# EAGLE design mml_matrix (EAGLE 9.7.0)
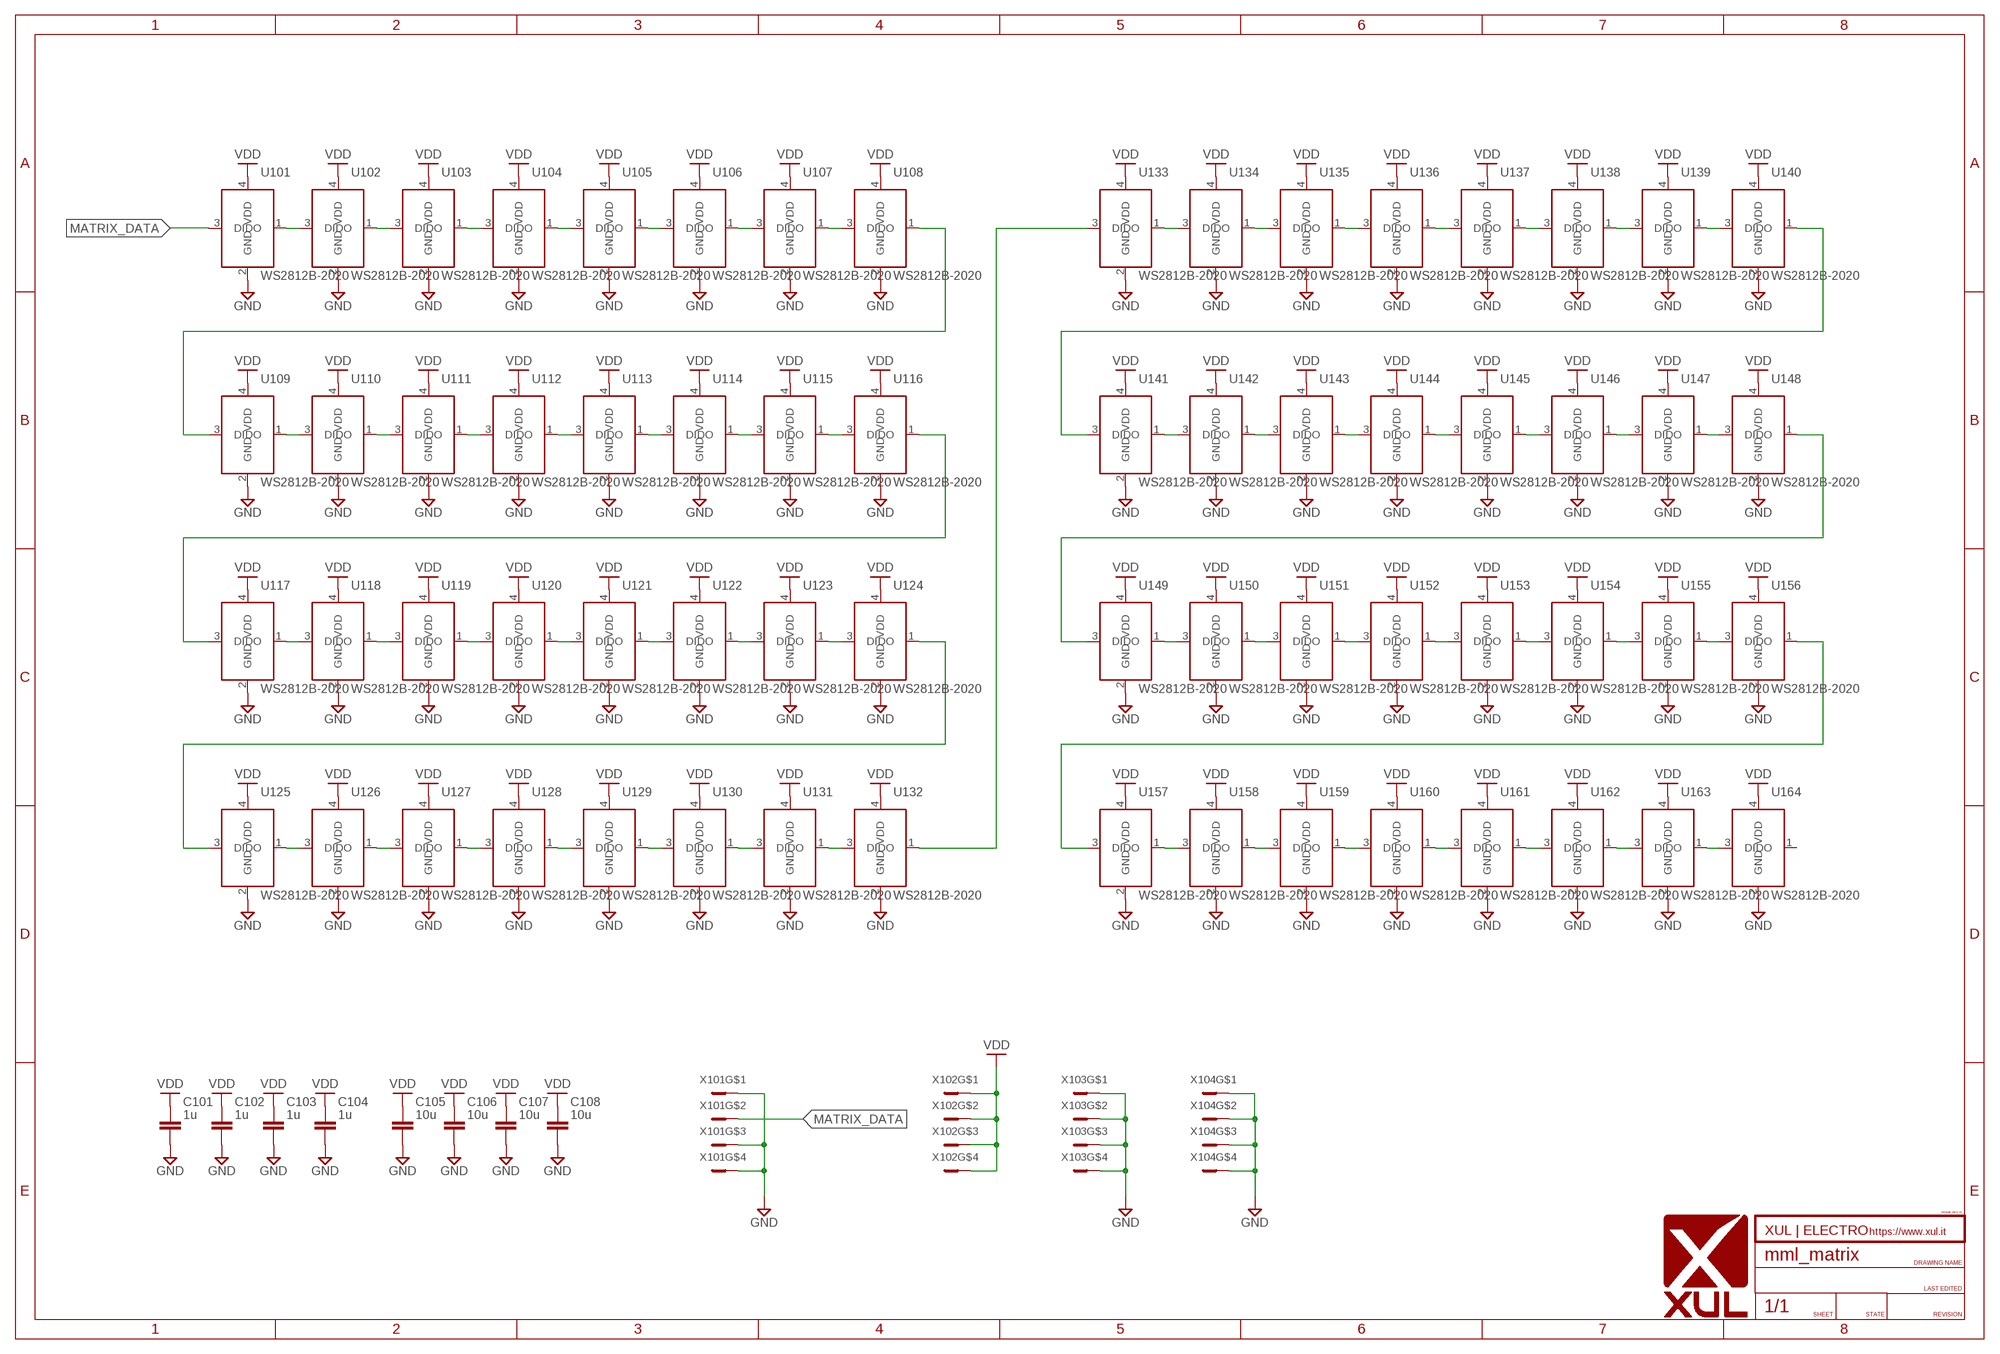
[diagram p0: schematic, sheet 1]

## Parts
C101  1u  C_CHIP-0603(1608-METRIC)  [CAPC1608X85]
C102  1u  C_CHIP-0603(1608-METRIC)  [CAPC1608X85]
C103  1u  C_CHIP-0603(1608-METRIC)  [CAPC1608X85]
C104  1u  C_CHIP-0603(1608-METRIC)  [CAPC1608X85]
C105  10u  C_CHIP-0805(2012-METRIC)  [CAPC2012X110]
C106  10u  C_CHIP-0805(2012-METRIC)  [CAPC2012X110]
C107  10u  C_CHIP-0805(2012-METRIC)  [CAPC2012X110]
C108  10u  C_CHIP-0805(2012-METRIC)  [CAPC2012X110]
U101  WS2812B-2020  [RESCAV100P200X220X28-4L]
U102  WS2812B-2020  [RESCAV100P200X220X28-4L]
U103  WS2812B-2020  [RESCAV100P200X220X28-4L]
U104  WS2812B-2020  [RESCAV100P200X220X28-4L]
U105  WS2812B-2020  [RESCAV100P200X220X28-4L]
U106  WS2812B-2020  [RESCAV100P200X220X28-4L]
U107  WS2812B-2020  [RESCAV100P200X220X28-4L]
U108  WS2812B-2020  [RESCAV100P200X220X28-4L]
U109  WS2812B-2020  [RESCAV100P200X220X28-4L]
U110  WS2812B-2020  [RESCAV100P200X220X28-4L]
U111  WS2812B-2020  [RESCAV100P200X220X28-4L]
U112  WS2812B-2020  [RESCAV100P200X220X28-4L]
U113  WS2812B-2020  [RESCAV100P200X220X28-4L]
U114  WS2812B-2020  [RESCAV100P200X220X28-4L]
U115  WS2812B-2020  [RESCAV100P200X220X28-4L]
U116  WS2812B-2020  [RESCAV100P200X220X28-4L]
U117  WS2812B-2020  [RESCAV100P200X220X28-4L]
U118  WS2812B-2020  [RESCAV100P200X220X28-4L]
U119  WS2812B-2020  [RESCAV100P200X220X28-4L]
U120  WS2812B-2020  [RESCAV100P200X220X28-4L]
U121  WS2812B-2020  [RESCAV100P200X220X28-4L]
U122  WS2812B-2020  [RESCAV100P200X220X28-4L]
U123  WS2812B-2020  [RESCAV100P200X220X28-4L]
U124  WS2812B-2020  [RESCAV100P200X220X28-4L]
U125  WS2812B-2020  [RESCAV100P200X220X28-4L]
U126  WS2812B-2020  [RESCAV100P200X220X28-4L]
U127  WS2812B-2020  [RESCAV100P200X220X28-4L]
U128  WS2812B-2020  [RESCAV100P200X220X28-4L]
U129  WS2812B-2020  [RESCAV100P200X220X28-4L]
U130  WS2812B-2020  [RESCAV100P200X220X28-4L]
U131  WS2812B-2020  [RESCAV100P200X220X28-4L]
U132  WS2812B-2020  [RESCAV100P200X220X28-4L]
U133  WS2812B-2020  [RESCAV100P200X220X28-4L]
U134  WS2812B-2020  [RESCAV100P200X220X28-4L]
U135  WS2812B-2020  [RESCAV100P200X220X28-4L]
U136  WS2812B-2020  [RESCAV100P200X220X28-4L]
U137  WS2812B-2020  [RESCAV100P200X220X28-4L]
U138  WS2812B-2020  [RESCAV100P200X220X28-4L]
U139  WS2812B-2020  [RESCAV100P200X220X28-4L]
U140  WS2812B-2020  [RESCAV100P200X220X28-4L]
U141  WS2812B-2020  [RESCAV100P200X220X28-4L]
U142  WS2812B-2020  [RESCAV100P200X220X28-4L]
U143  WS2812B-2020  [RESCAV100P200X220X28-4L]
U144  WS2812B-2020  [RESCAV100P200X220X28-4L]
U145  WS2812B-2020  [RESCAV100P200X220X28-4L]
U146  WS2812B-2020  [RESCAV100P200X220X28-4L]
U147  WS2812B-2020  [RESCAV100P200X220X28-4L]
U148  WS2812B-2020  [RESCAV100P200X220X28-4L]
U149  WS2812B-2020  [RESCAV100P200X220X28-4L]
U150  WS2812B-2020  [RESCAV100P200X220X28-4L]
U151  WS2812B-2020  [RESCAV100P200X220X28-4L]
U152  WS2812B-2020  [RESCAV100P200X220X28-4L]
U153  WS2812B-2020  [RESCAV100P200X220X28-4L]
U154  WS2812B-2020  [RESCAV100P200X220X28-4L]
U155  WS2812B-2020  [RESCAV100P200X220X28-4L]
U156  WS2812B-2020  [RESCAV100P200X220X28-4L]
U157  WS2812B-2020  [RESCAV100P200X220X28-4L]
U158  WS2812B-2020  [RESCAV100P200X220X28-4L]
U159  WS2812B-2020  [RESCAV100P200X220X28-4L]
U160  WS2812B-2020  [RESCAV100P200X220X28-4L]
U161  WS2812B-2020  [RESCAV100P200X220X28-4L]
U162  WS2812B-2020  [RESCAV100P200X220X28-4L]
U163  WS2812B-2020  [RESCAV100P200X220X28-4L]
U164  WS2812B-2020  [RESCAV100P200X220X28-4L]
X101  HW-02-10-T-D-500-SM  [HW-02-10-T-D-500-SM]
X102  HW-02-10-T-D-500-SM  [HW-02-10-T-D-500-SM]
X103  HW-02-10-T-D-500-SM  [HW-02-10-T-D-500-SM]
X104  HW-02-10-T-D-500-SM  [HW-02-10-T-D-500-SM]

## Nets
GND: C101.2 C102.2 C103.2 C104.2 C105.2 C106.2 C107.2 C108.2 U101.2(GND) U102.2(GND) U103.2(GND) U104.2(GND) U105.2(GND) U106.2(GND) U107.2(GND) U108.2(GND) U109.2(GND) U110.2(GND) U111.2(GND) U112.2(GND) U113.2(GND) U114.2(GND) U115.2(GND) U116.2(GND) U117.2(GND) U118.2(GND) U119.2(GND) U120.2(GND) U121.2(GND) U122.2(GND) U123.2(GND) U124.2(GND) U125.2(GND) U126.2(GND) U127.2(GND) U128.2(GND) U129.2(GND) U130.2(GND) U131.2(GND) U132.2(GND) U133.2(GND) U134.2(GND) U135.2(GND) U136.2(GND) U137.2(GND) U138.2(GND) U139.2(GND) U140.2(GND) U141.2(GND) U142.2(GND) U143.2(GND) U144.2(GND) U145.2(GND) U146.2(GND) U147.2(GND) U148.2(GND) U149.2(GND) U150.2(GND) U151.2(GND) U152.2(GND) U153.2(GND) U154.2(GND) U155.2(GND) U156.2(GND) U157.2(GND) U158.2(GND) U159.2(GND) U160.2(GND) U161.2(GND) U162.2(GND) U163.2(GND) U164.2(GND) X101.P$1 X101.P$3 X101.P$4 X103.P$1 X103.P$2 X103.P$3 X103.P$4 X104.P$1 X104.P$2 X104.P$3 X104.P$4
MATRIX_DATA: U101.3(DI) X101.P$2
N$1: U101.1(DO) U102.3(DI)
N$2: U102.1(DO) U103.3(DI)
N$3: U103.1(DO) U104.3(DI)
N$4: U104.1(DO) U105.3(DI)
N$5: U105.1(DO) U106.3(DI)
N$6: U106.1(DO) U107.3(DI)
N$7: U107.1(DO) U108.3(DI)
N$8: U117.1(DO) U118.3(DI)
N$9: U118.1(DO) U119.3(DI)
N$10: U119.1(DO) U120.3(DI)
N$11: U120.1(DO) U121.3(DI)
N$12: U121.1(DO) U122.3(DI)
N$13: U122.1(DO) U123.3(DI)
N$14: U123.1(DO) U124.3(DI)
N$15: U133.1(DO) U134.3(DI)
N$16: U134.1(DO) U135.3(DI)
N$17: U135.1(DO) U136.3(DI)
N$18: U136.1(DO) U137.3(DI)
N$19: U137.1(DO) U138.3(DI)
N$20: U138.1(DO) U139.3(DI)
N$21: U139.1(DO) U140.3(DI)
N$22: U149.1(DO) U150.3(DI)
N$23: U150.1(DO) U151.3(DI)
N$24: U151.1(DO) U152.3(DI)
N$25: U152.1(DO) U153.3(DI)
N$26: U153.1(DO) U154.3(DI)
N$27: U154.1(DO) U155.3(DI)
N$28: U155.1(DO) U156.3(DI)
N$29: U109.1(DO) U110.3(DI)
N$30: U110.1(DO) U111.3(DI)
N$31: U111.1(DO) U112.3(DI)
N$32: U112.1(DO) U113.3(DI)
N$33: U113.1(DO) U114.3(DI)
N$34: U114.1(DO) U115.3(DI)
N$35: U115.1(DO) U116.3(DI)
N$36: U125.1(DO) U126.3(DI)
N$37: U126.1(DO) U127.3(DI)
N$38: U127.1(DO) U128.3(DI)
N$39: U128.1(DO) U129.3(DI)
N$40: U129.1(DO) U130.3(DI)
N$41: U130.1(DO) U131.3(DI)
N$42: U131.1(DO) U132.3(DI)
N$43: U141.1(DO) U142.3(DI)
N$44: U142.1(DO) U143.3(DI)
N$45: U143.1(DO) U144.3(DI)
N$46: U144.1(DO) U145.3(DI)
N$47: U145.1(DO) U146.3(DI)
N$48: U146.1(DO) U147.3(DI)
N$49: U147.1(DO) U148.3(DI)
N$50: U157.1(DO) U158.3(DI)
N$51: U158.1(DO) U159.3(DI)
N$52: U159.1(DO) U160.3(DI)
N$53: U160.1(DO) U161.3(DI)
N$54: U161.1(DO) U162.3(DI)
N$55: U162.1(DO) U163.3(DI)
N$56: U163.1(DO) U164.3(DI)
N$57: U108.1(DO) U109.3(DI)
N$58: U116.1(DO) U117.3(DI)
N$59: U124.1(DO) U125.3(DI)
N$60: U132.1(DO) U133.3(DI)
N$61: U140.1(DO) U141.3(DI)
N$62: U148.1(DO) U149.3(DI)
N$63: U156.1(DO) U157.3(DI)
VDD: C101.1 C102.1 C103.1 C104.1 C105.1 C106.1 C107.1 C108.1 U101.4(VDD) U102.4(VDD) U103.4(VDD) U104.4(VDD) U105.4(VDD) U106.4(VDD) U107.4(VDD) U108.4(VDD) U109.4(VDD) U110.4(VDD) U111.4(VDD) U112.4(VDD) U113.4(VDD) U114.4(VDD) U115.4(VDD) U116.4(VDD) U117.4(VDD) U118.4(VDD) U119.4(VDD) U120.4(VDD) U121.4(VDD) U122.4(VDD) U123.4(VDD) U124.4(VDD) U125.4(VDD) U126.4(VDD) U127.4(VDD) U128.4(VDD) U129.4(VDD) U130.4(VDD) U131.4(VDD) U132.4(VDD) U133.4(VDD) U134.4(VDD) U135.4(VDD) U136.4(VDD) U137.4(VDD) U138.4(VDD) U139.4(VDD) U140.4(VDD) U141.4(VDD) U142.4(VDD) U143.4(VDD) U144.4(VDD) U145.4(VDD) U146.4(VDD) U147.4(VDD) U148.4(VDD) U149.4(VDD) U150.4(VDD) U151.4(VDD) U152.4(VDD) U153.4(VDD) U154.4(VDD) U155.4(VDD) U156.4(VDD) U157.4(VDD) U158.4(VDD) U159.4(VDD) U160.4(VDD) U161.4(VDD) U162.4(VDD) U163.4(VDD) U164.4(VDD) X102.P$1 X102.P$2 X102.P$3 X102.P$4
Unconnected: U164.1(DO)

## Library data of the parts
C101-C108 = Capacitor:C: Capacitor - Generic; CATEGORY: Capacitor
U101-U164 = xul:WS2812B
X101-X104 = xul:HW-02-10-T-D-500-SM: HW-02-10-T-D-500-SM 2x2 SMD High Temperature Flexible Board Stacking Header, 0.100" Pitch

## Board
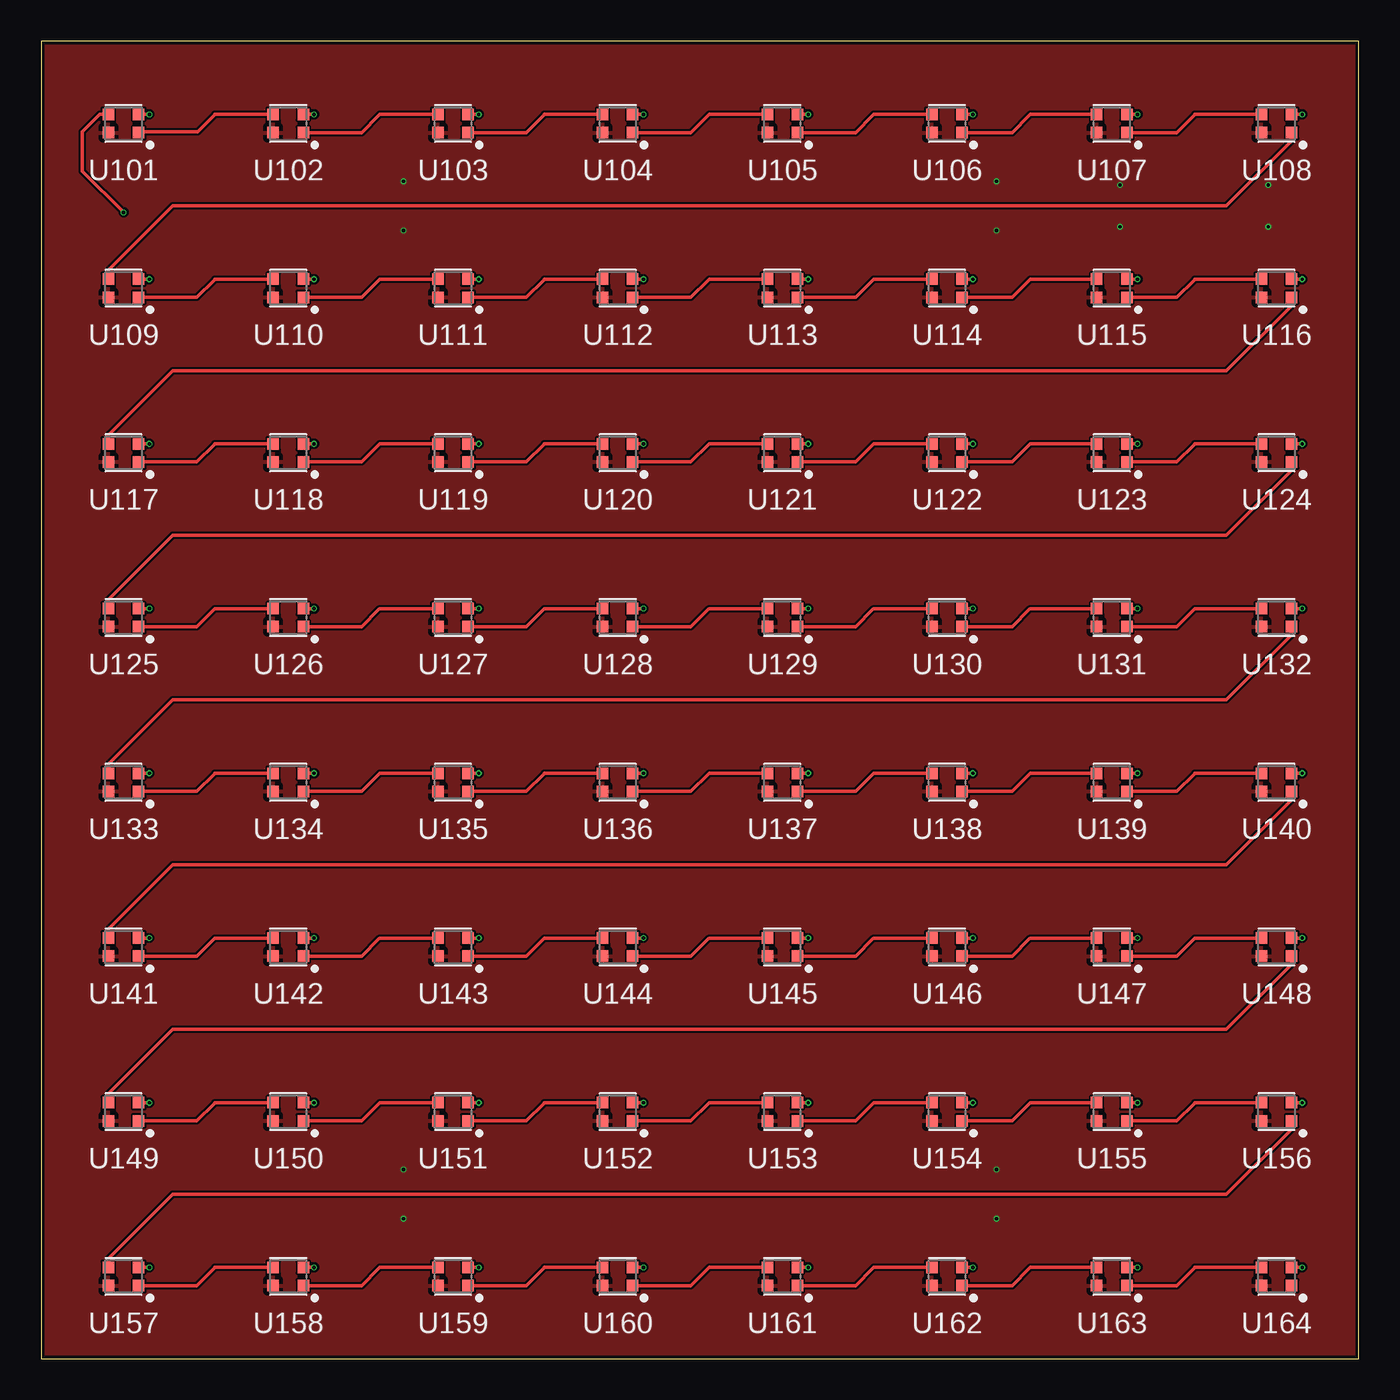
[diagram p1: board, top side]
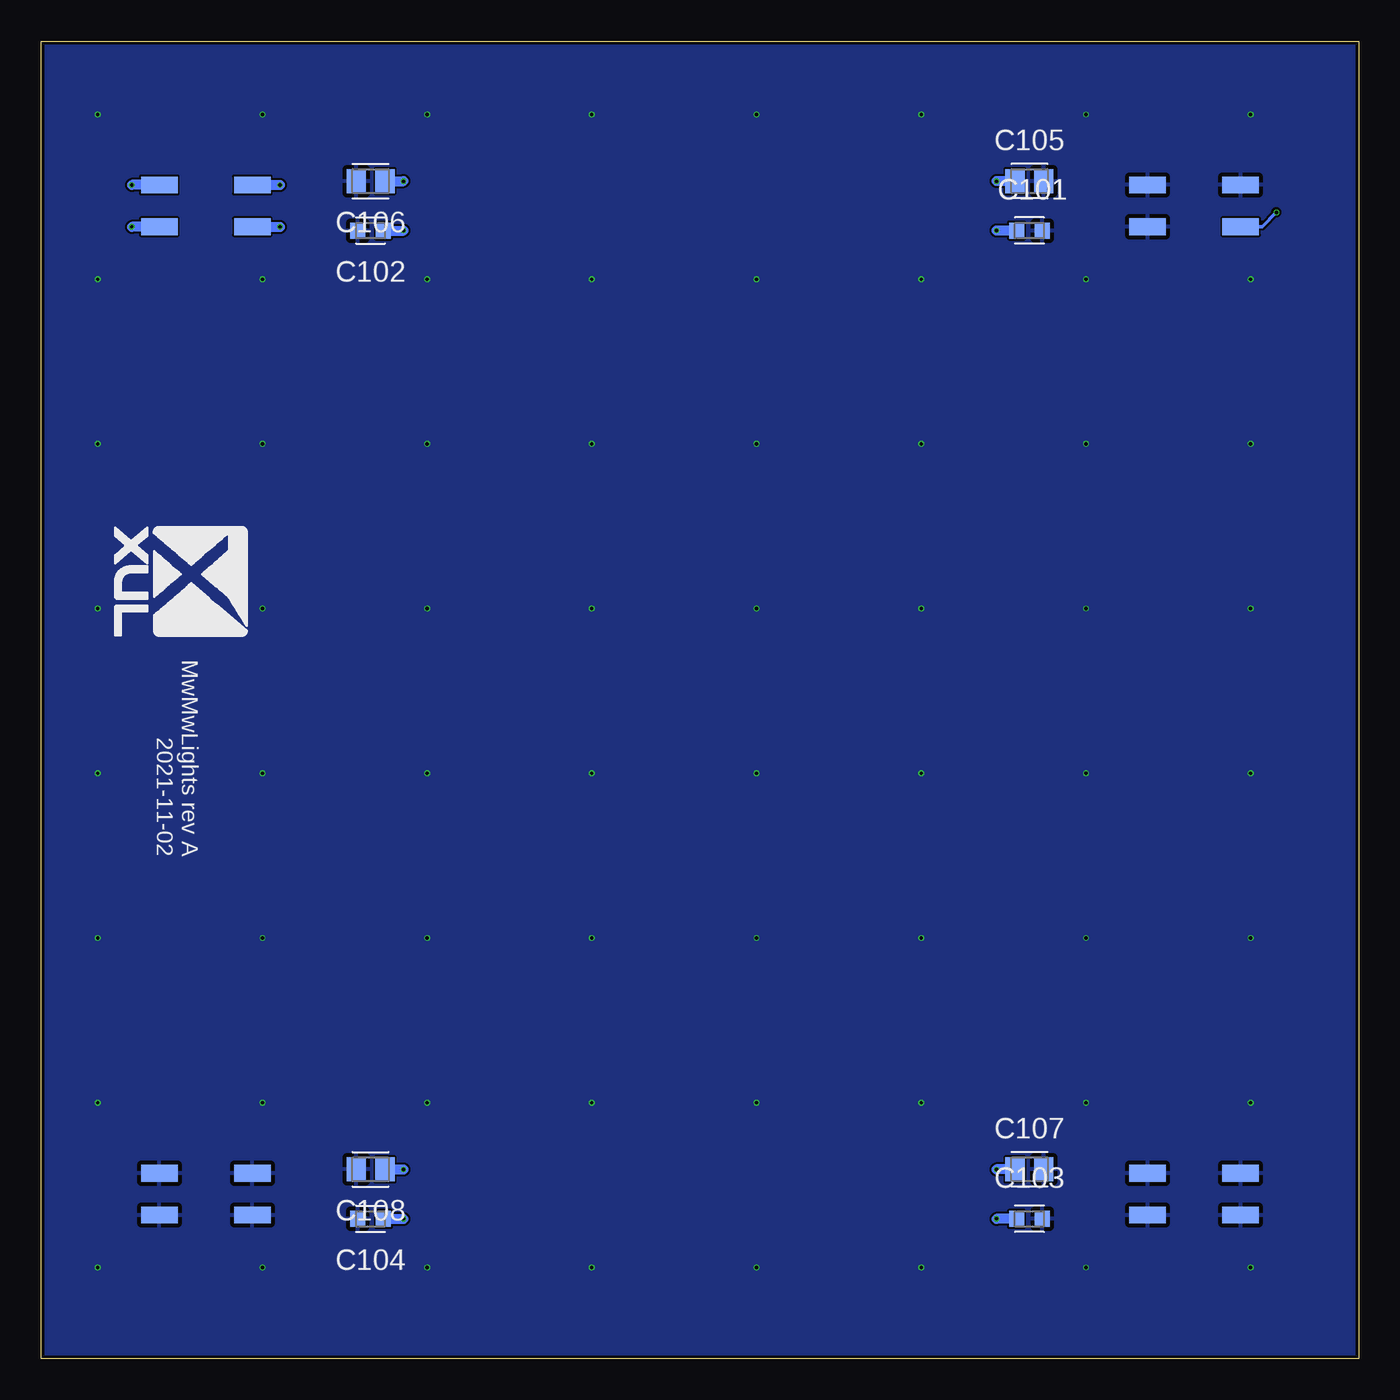
[diagram p2: board, bottom side, seen from below]

Size 80 x 80 mm. Coordinates in mm from the lower left corner, seen from the top.
Outline: 0,0 80,0 80,80 0,80 0,0
Copper layers (1*16): Top 0.035mm / dielectric 1.6mm / Bottom 0.035mm
Design rules "jlcpcb-2layers *": minimum track width 5mil, minimum drill 0.2mm, track to track 5mil, track to pad 5mil, pad to pad 5mil, via to via 5mil, smd to smd 5mil, copper to edge 0.2mm, drill to drill 6mil, minimum pad ring 10mil, minimum via ring 3mil, stop-mask expansion 4mil, vias tented up to drill 0mil, thermal gap 10mil

### Footprints (pad centres in the part's own frame; a part is rotated, then mirrored left to right if it is on the bottom)
CAPC1608X85 = smd 0.921 x 0.97: 1 -0.775,0; 2 0.775,0
CAPC2012X110 = smd 1.165 x 1.465: 1 -0.875,0; 2 0.875,0
RESCAV100P200X220X28-4L = smd 0.7 x 0.7: 1 -0.915,0.55; 2 -0.915,-0.55; 3 0.915,-0.55; 4 0.915,0.55
HW-02-10-T-D-500-SM = smd 1.016 x 2.223: P$1 -1.27,2.826; P$2 1.27,2.826; P$3 -1.27,-2.826; P$4 1.27,-2.826

### Placement (x,y rotation side)
C101  20,68.5 0 bottom
C102  60,68.5 180 bottom
C103  20,8.5 0 bottom
C104  60,8.5 180 bottom
C105  20,71.5 0 bottom
C106  60,71.5 180 bottom
C107  20,11.5 0 bottom
C108  60,11.5 180 bottom
U101  5,75 180 top
U102  15,75 180 top
U103  25,75 180 top
U104  35,75 180 top
U105  45,75 180 top
U106  55,75 180 top
U107  65,75 180 top
U108  75,75 180 top
U109  5,65 180 top
U110  15,65 180 top
U111  25,65 180 top
U112  35,65 180 top
U113  45,65 180 top
U114  55,65 180 top
U115  65,65 180 top
U116  75,65 180 top
U117  5,55 180 top
U118  15,55 180 top
U119  25,55 180 top
U120  35,55 180 top
U121  45,55 180 top
U122  55,55 180 top
U123  65,55 180 top
U124  75,55 180 top
U125  5,45 180 top
U126  15,45 180 top
U127  25,45 180 top
U128  35,45 180 top
U129  45,45 180 top
U130  55,45 180 top
U131  65,45 180 top
U132  75,45 180 top
U133  5,35 180 top
U134  15,35 180 top
U135  25,35 180 top
U136  35,35 180 top
U137  45,35 180 top
U138  55,35 180 top
U139  65,35 180 top
U140  75,35 180 top
U141  5,25 180 top
U142  15,25 180 top
U143  25,25 180 top
U144  35,25 180 top
U145  45,25 180 top
U146  55,25 180 top
U147  65,25 180 top
U148  75,25 180 top
U149  5,15 180 top
U150  15,15 180 top
U151  25,15 180 top
U152  35,15 180 top
U153  45,15 180 top
U154  55,15 180 top
U155  65,15 180 top
U156  75,15 180 top
U157  5,5 180 top
U158  15,5 180 top
U159  25,5 180 top
U160  35,5 180 top
U161  45,5 180 top
U162  55,5 180 top
U163  65,5 180 top
U164  75,5 180 top
U$1  [XUL-LOGO-8MMH]  67.5,50.5 270 bottom
X101  10,70 270 bottom
X102  70,70 90 bottom
X103  10,10 270 bottom
X104  70,10 90 bottom

### Tracks (layer width: path | path; a pad name or v marks a point on that pad's centre or on a via)
GND  (via drill 0.2)
  Top 0.2: U142.2 v16.57,25.55 | U121.2 v46.57,55.55 | U143.2 v26.57,25.55 | U125.2 v6.57,45.55 | U146.2 v56.57,25.55 | U130.2 v56.57,45.55 | U104.2 v36.57,75.55 | U106.2 v56.57,75.55 | U101.2 v6.57,75.55 | U159.2 v26.57,5.55 | U112.2 v36.57,65.55 | U156.2 v76.57,15.55 | U160.2 v36.57,5.55 | U154.2 v56.57,15.55 | U110.2 v16.57,65.55 | U116.2 v76.57,65.55 | U109.2 v6.57,65.55 | U118.2 v16.57,55.55 | U145.2 v46.57,25.55 | U150.2 v16.57,15.55 | U102.2 v16.57,75.55 | U135.2 v26.57,35.55 | U119.2 v26.57,55.55 | U103.2 v26.57,75.55 | U107.2 v66.57,75.55 | U157.2 v6.57,5.55 | U136.2 v36.57,35.55 | U105.2 v46.57,75.55 | U139.2 v66.57,35.55 | U126.2 v16.57,45.55 | U113.2 v46.57,65.55 | U117.2 v6.57,55.55 | U141.2 v6.57,25.55 | U114.2 v56.57,65.55 | U134.2 v16.57,35.55 | U163.2 v66.57,5.55 | U108.2 v76.57,75.55 | U162.2 v56.57,5.55 | U111.2 v26.57,65.55 | U127.2 v26.57,45.55 | U120.2 v36.57,55.55 | U144.2 v36.57,25.55 | U122.2 v56.57,55.55 | U123.2 v66.57,55.55 | U128.2 v36.57,45.55 | U124.2 v76.57,55.55 | U133.2 v6.57,35.55 | U137.2 v46.57,35.55 | U140.2 v76.57,35.55 | U155.2 v66.57,15.55 | U158.2 v16.57,5.55 | U138.2 v56.57,35.55 | U149.2 v6.57,15.55 | U153.2 v46.57,15.55 | U151.2 v26.57,15.55 | U152.2 v36.57,15.55 | U148.2 v76.57,25.55 | U115.2 v66.57,65.55 | U164.2 v76.57,5.55 | U129.2 v46.57,45.55 | U131.2 v66.57,45.55 | U147.2 v66.57,25.55 | U132.2 v76.57,45.55 | U161.2 v46.57,5.55
  pour Bottom: 0.08,0.08 79.92,0.08 79.92,79.92 0.08,79.92
MATRIX_DATA  (via drill 0.2)
  Top 0.2: v5,69.6 2.5,72.1 2.5,74.5 3.55,75.55 U101.3
  Bottom 0.2: X101.P$2 5.87,68.73 v5,69.6
N$1
  Top 0.2: U101.1 5.96,74.5 9.5,74.5 10.5,75.5 10.55,75.55 U102.3
N$2
  Top 0.2: U102.1 19.45,74.45 20.5,75.5 20.55,75.55 U103.3
N$3
  Top 0.2: U103.1 29.45,74.45 30.5,75.5 30.55,75.55 U104.3
N$4
  Top 0.2: U104.1 39.45,74.45 40.5,75.5 40.55,75.55 U105.3
N$5
  Top 0.2: U105.1 49.45,74.45 50.5,75.5 50.55,75.55 U106.3
N$6
  Top 0.2: U106.1 58.95,74.45 60,75.5 60.05,75.55 U107.3
N$7
  Top 0.2: U107.1 68.95,74.45 70,75.5 70.05,75.55 U108.3
N$8
  Top 0.2: U117.1 9.45,54.45 10.5,55.5 10.55,55.55 U118.3
N$9
  Top 0.2: U118.1 19.45,54.45 20.5,55.5 20.55,55.55 U119.3
N$10
  Top 0.2: U119.1 29.45,54.45 30.5,55.5 30.55,55.55 U120.3
N$11
  Top 0.2: U120.1 39.45,54.45 40.5,55.5 40.55,55.55 U121.3
N$12
  Top 0.2: U121.1 49.45,54.45 50.5,55.5 50.55,55.55 U122.3
N$13
  Top 0.2: U122.1 58.95,54.45 60,55.5 60.05,55.55 U123.3
N$14
  Top 0.2: U123.1 68.95,54.45 70,55.5 70.05,55.55 U124.3
N$15
  Top 0.2: U133.1 9.45,34.45 10.5,35.5 10.55,35.55 U134.3
N$16
  Top 0.2: U134.1 19.45,34.45 20.5,35.5 20.55,35.55 U135.3
N$17
  Top 0.2: U135.1 29.45,34.45 30.5,35.5 30.55,35.55 U136.3
N$18
  Top 0.2: U136.1 39.45,34.45 40.5,35.5 40.55,35.55 U137.3
N$19
  Top 0.2: U137.1 49.45,34.45 50.5,35.5 50.55,35.55 U138.3
N$20
  Top 0.2: U138.1 58.95,34.45 60,35.5 60.05,35.55 U139.3
N$21
  Top 0.2: U139.1 68.95,34.45 70,35.5 70.05,35.55 U140.3
N$22
  Top 0.2: U149.1 9.45,14.45 10.5,15.5 10.55,15.55 U150.3
N$23
  Top 0.2: U150.1 19.45,14.45 20.5,15.5 20.55,15.55 U151.3
N$24
  Top 0.2: U151.1 29.45,14.45 30.5,15.5 30.55,15.55 U152.3
N$25
  Top 0.2: U152.1 39.45,14.45 40.5,15.5 40.55,15.55 U153.3
N$26
  Top 0.2: U153.1 49.45,14.45 50.5,15.5 50.55,15.55 U154.3
N$27
  Top 0.2: U154.1 58.95,14.45 60,15.5 60.05,15.55 U155.3
N$28
  Top 0.2: U155.1 68.95,14.45 70,15.5 70.05,15.55 U156.3
N$29
  Top 0.2: U109.1 9.45,64.45 10.5,65.5 10.55,65.55 U110.3
N$30
  Top 0.2: U110.1 19.45,64.45 20.5,65.5 20.55,65.55 U111.3
N$31
  Top 0.2: U111.1 29.45,64.45 30.5,65.5 30.55,65.55 U112.3
N$32
  Top 0.2: U112.1 39.45,64.45 40.5,65.5 40.55,65.55 U113.3
N$33
  Top 0.2: U113.1 49.45,64.45 50.5,65.5 50.55,65.55 U114.3
N$34
  Top 0.2: U114.1 58.95,64.45 60,65.5 60.05,65.55 U115.3
N$35
  Top 0.2: U115.1 68.95,64.45 70,65.5 70.05,65.55 U116.3
N$36
  Top 0.2: U125.1 9.45,44.45 10.5,45.5 10.55,45.55 U126.3
N$37
  Top 0.2: U126.1 19.45,44.45 20.5,45.5 20.55,45.55 U127.3
N$38
  Top 0.2: U127.1 29.45,44.45 30.5,45.5 30.55,45.55 U128.3
N$39
  Top 0.2: U128.1 39.45,44.45 40.5,45.5 40.55,45.55 U129.3
N$40
  Top 0.2: U129.1 49.45,44.45 50.5,45.5 50.55,45.55 U130.3
N$41
  Top 0.2: U130.1 58.95,44.45 60,45.5 60.05,45.55 U131.3
N$42
  Top 0.2: U131.1 68.95,44.45 70,45.5 70.05,45.55 U132.3
N$43
  Top 0.2: U141.1 9.45,24.45 10.5,25.5 10.55,25.55 U142.3
N$44
  Top 0.2: U142.1 19.45,24.45 20.5,25.5 20.55,25.55 U143.3
N$45
  Top 0.2: U143.1 29.45,24.45 30.5,25.5 30.55,25.55 U144.3
N$46
  Top 0.2: U144.1 39.45,24.45 40.5,25.5 40.55,25.55 U145.3
N$47
  Top 0.2: U145.1 49.45,24.45 50.5,25.5 50.55,25.55 U146.3
N$48
  Top 0.2: U146.1 58.95,24.45 60,25.5 60.05,25.55 U147.3
N$49
  Top 0.2: U147.1 68.95,24.45 70,25.5 70.05,25.55 U148.3
N$50
  Top 0.2: U157.1 9.45,4.45 10.5,5.5 10.55,5.55 U158.3
N$51
  Top 0.2: U158.1 19.45,4.45 20.5,5.5 20.55,5.55 U159.3
N$52
  Top 0.2: U159.1 29.45,4.45 30.5,5.5 30.55,5.55 U160.3
N$53
  Top 0.2: U160.1 39.45,4.45 40.5,5.5 40.55,5.55 U161.3
N$54
  Top 0.2: U161.1 49.45,4.45 50.5,5.5 50.55,5.55 U162.3
N$55
  Top 0.2: U162.1 58.95,4.45 60,5.5 60.05,5.55 U163.3
N$56
  Top 0.2: U163.1 68.95,4.45 70,5.5 70.05,5.55 U164.3
N$57
  Top 0.2: U108.1 75.92,73.95 71.97,70 8,70 4.08,66.08 U109.3
N$58
  Top 0.2: U116.1 75.92,63.95 71.97,60 8,60 4.08,56.09 U117.3
N$59
  Top 0.2: U124.1 75.92,53.95 71.97,50 8,50 4.08,46.09 U125.3
N$60
  Top 0.2: U132.1 75.92,43.95 71.97,40 8,40 4.08,36.09 U133.3
N$61
  Top 0.2: U140.1 75.92,33.95 71.97,30 8,30 4.08,26.09 U141.3
N$62
  Top 0.2: U148.1 75.92,23.95 71.97,20 8,20 4.08,16.09 U149.3
N$63
  Top 0.2: U156.1 75.92,13.95 71.97,10 8,10 4.08,6.08 U157.3
VDD  (via drill 0.2)
  Bottom 0.6: C106.1 v58,71.5 | C102.1 v58,68.5 | C105.1 v22,71.5 | C101.1 v22,68.5 | C107.1 v22,11.5 | C103.1 v22,8.5 | C108.1 v58,11.5 | C104.1 v58,8.5 | X102.P$2 v74.5,71.27 | X102.P$1 v74.5,68.73 | X102.P$4 v65.5,71.27 | X102.P$3 v65.5,68.73
  pour Top: 0.08,0.08 79.92,0.08 79.92,79.92 0.08,79.92

### Text on the board
bPlace: MwMwLights rev A / 2021-11-02